# Altium schematic sheet Historial de revisiones.SchDoc
size A4; SheetNumber: 2; SheetTotal: 6
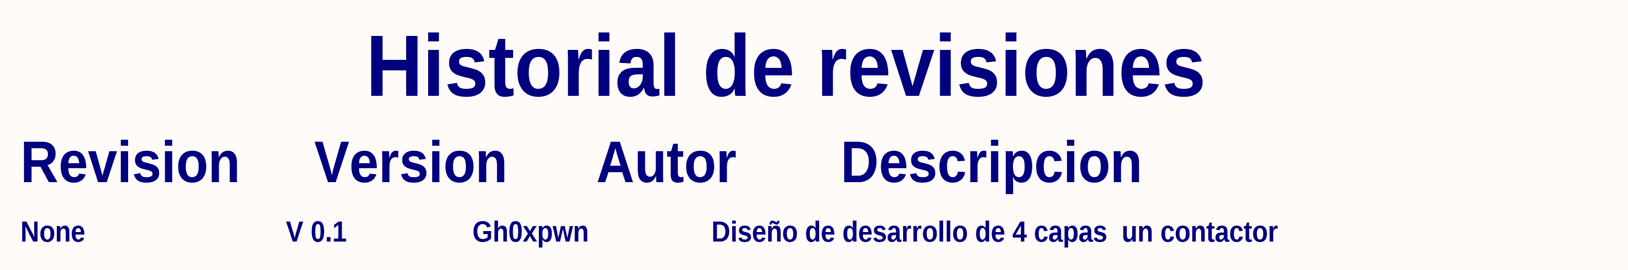
[diagram p0: Historial de revisiones.SchDoc]

## Notes on the sheet
- Historial de revisiones
- Revision     Version      Autor       Descripcion
- None
- V 0.1
- Gh0xpwn
- Diseño de desarrollo de 4 capas  un contactor